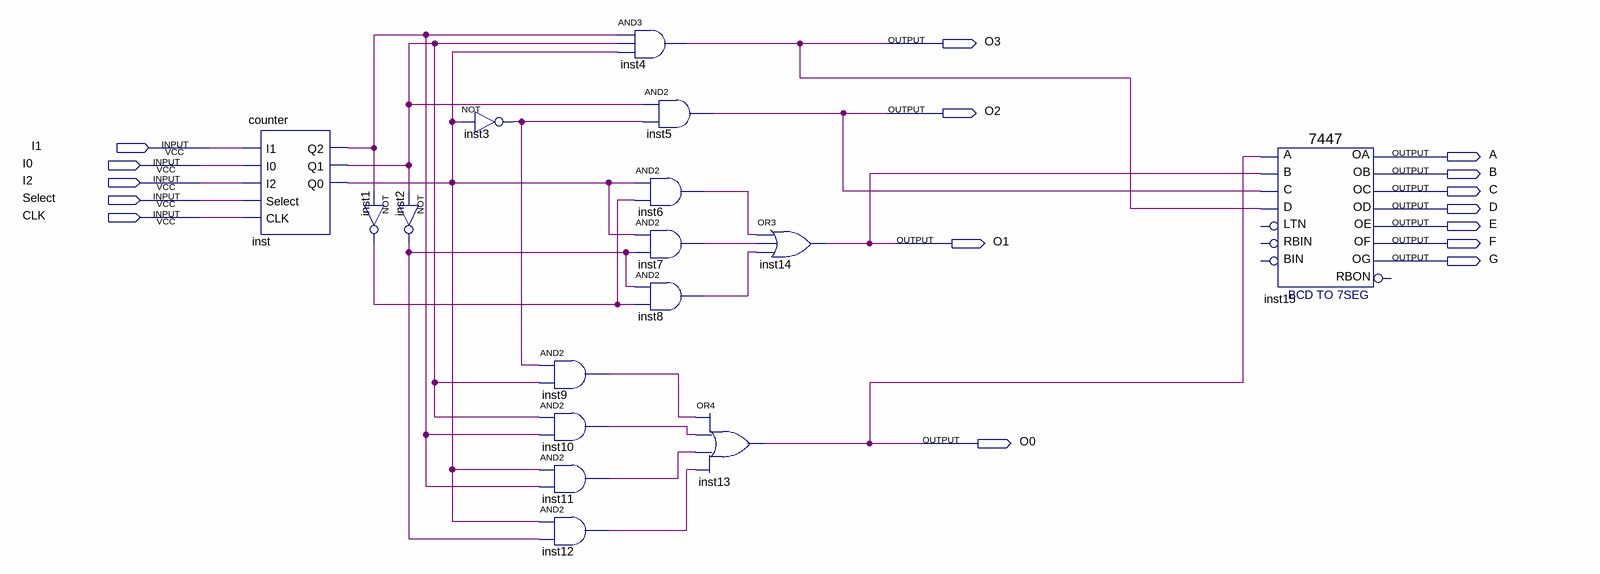
[diagram p0: schematic sheet]
// Quartus schematic DongBo.bdf as structural Verilog: 16 symbols, 16 pins
module DongBo (
  input  I1,
  input  I0,
  input  I2,
  input  Select,
  input  CLK,
  output O3,
  output O2,
  output A,
  output B,
  output C,
  output D,
  output E,
  output O1,
  output F,
  output G,
  output O0
);

  wire inst1_out, inst2_out, inst3_out, inst6_out, inst7_out, inst8_out, inst9_out, inst10_out, inst11_out,
       inst12_out, inst_q0, inst_q1, inst_q2;

  counter inst (.I1(I1), .I0(I0), .I2(I2), .Select(Select), .CLK(CLK), .Q2(inst_q2), .Q1(inst_q1), .Q0(inst_q0));
  not inst1 (inst1_out, inst_q2);
  not inst2 (inst2_out, inst_q1);
  not inst3 (inst3_out, inst_q0);
  and inst9 (inst9_out, inst3_out, inst_q1);
  and inst10 (inst10_out, inst_q1, inst_q2);
  and inst11 (inst11_out, inst_q0, inst_q2);
  and inst12 (inst12_out, inst_q0, inst2_out);
  and inst4 (O3, inst_q2, inst_q1, inst_q0);
  and inst5 (O2, inst_q1, inst3_out);
  and inst6 (inst6_out, inst_q0, inst1_out);
  and inst7 (inst7_out, inst_q0, inst2_out);
  and inst8 (inst8_out, inst2_out, inst1_out);
  or inst13 (O0, inst9_out, inst10_out, inst11_out, inst12_out);
  or inst14 (O1, inst6_out, inst7_out, inst8_out);
  \7447  inst15 (
    .B(O1), .C(O2), .D(O3), .A(O0), .OB(B), .OC(C), .OE(E), .OD(D), .OF(F), .OG(G), .OA(A));  // open: LTN, RBIN, BIN, RBON
endmodule
